# EAGLE schematic R3-URC18-4-002 (EAGLE 8.3.2)
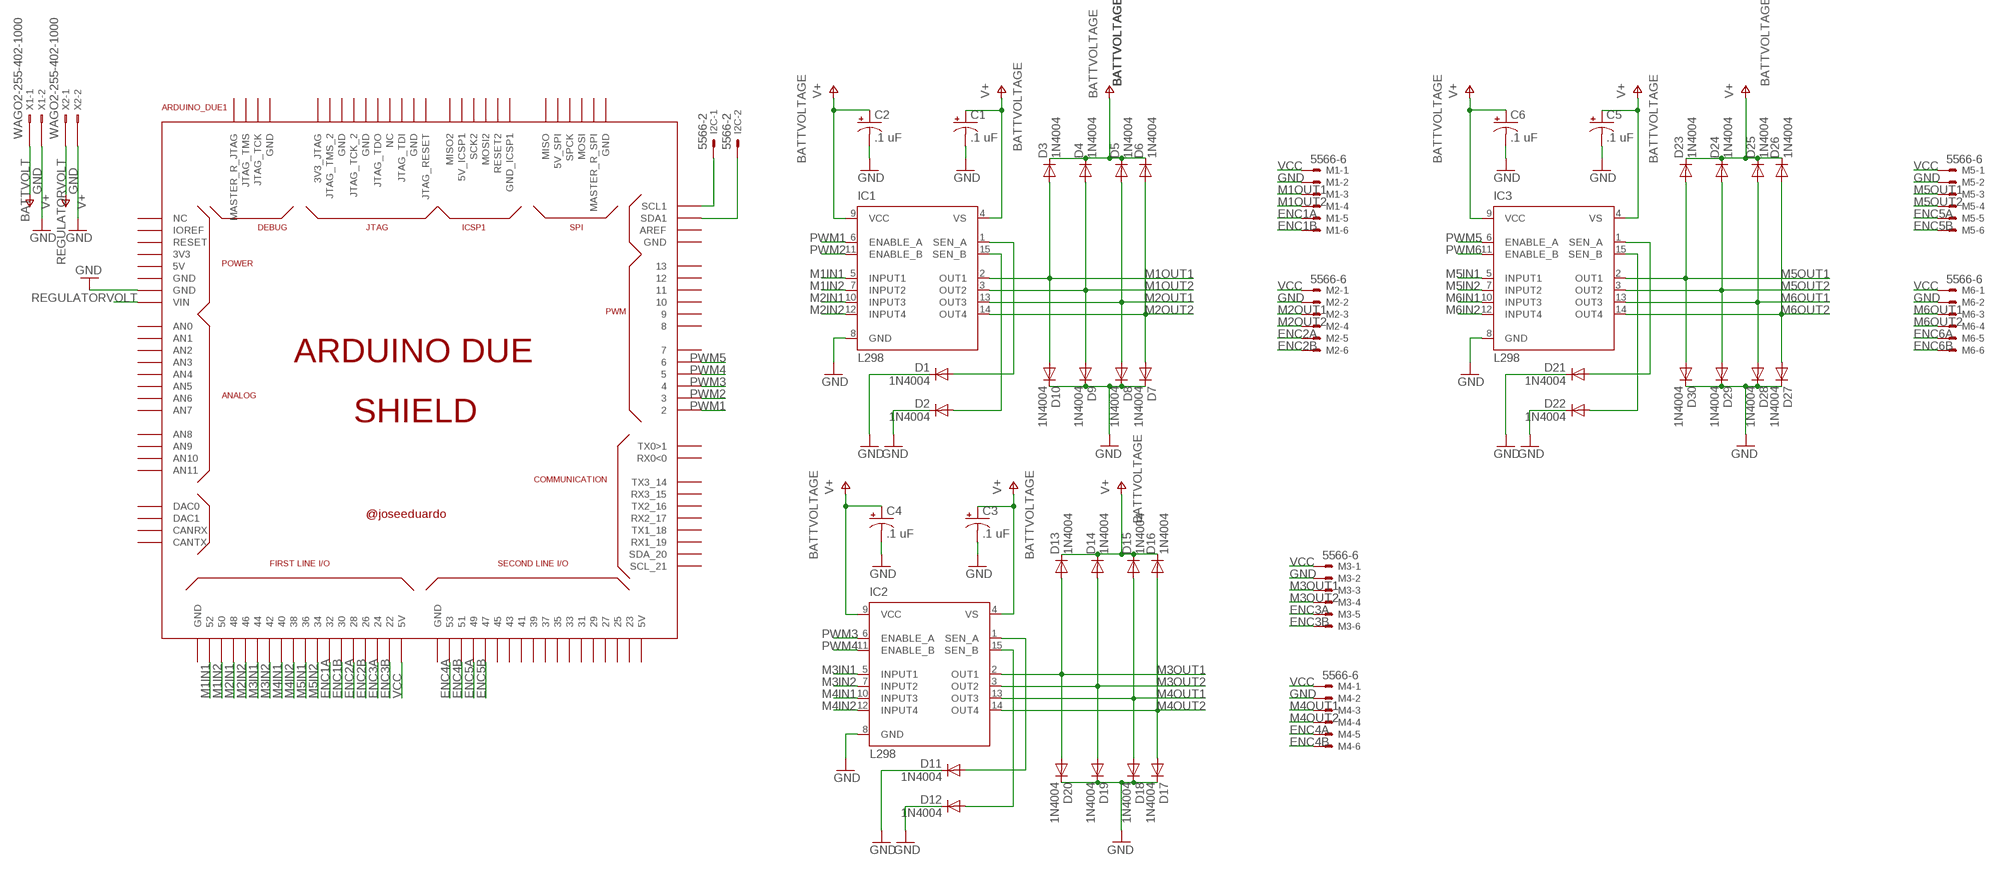
[diagram p0: schematic, sheet 1]

## Parts
ARDUINO_DUE1  ARDUINO_DUE_SHIELD  [ARDUINO_DUE_SHIELD]
C1  .1 uF  CPOL-USE5-6  [E5-6]
C2  .1 uF  CPOL-USE5-6  [E5-6]
C3  .1 uF  CPOL-USE5-6  [E5-6]
C4  .1 uF  CPOL-USE5-6  [E5-6]
C5  .1 uF  CPOL-USE5-6  [E5-6]
C6  .1 uF  CPOL-USE5-6  [E5-6]
D1  1N4004  [DO41-10]
D2  1N4004  [DO41-10]
D3  1N4004  [DO41-10]
D4  1N4004  [DO41-10]
D5  1N4004  [DO41-10]
D6  1N4004  [DO41-10]
D7  1N4004  [DO41-10]
D8  1N4004  [DO41-10]
D9  1N4004  [DO41-10]
D10  1N4004  [DO41-10]
D11  1N4004  [DO41-10]
D12  1N4004  [DO41-10]
D13  1N4004  [DO41-10]
D14  1N4004  [DO41-10]
D15  1N4004  [DO41-10]
D16  1N4004  [DO41-10]
D17  1N4004  [DO41-10]
D18  1N4004  [DO41-10]
D19  1N4004  [DO41-10]
D20  1N4004  [DO41-10]
D21  1N4004  [DO41-10]
D22  1N4004  [DO41-10]
D23  1N4004  [DO41-10]
D24  1N4004  [DO41-10]
D25  1N4004  [DO41-10]
D26  1N4004  [DO41-10]
D27  1N4004  [DO41-10]
D28  1N4004  [DO41-10]
D29  1N4004  [DO41-10]
D30  1N4004  [DO41-10]
I2C  5566-2  [5566-2]
IC1  L298  [MULTIWATT-15]
IC2  L298  [MULTIWATT-15]
IC3  L298  [MULTIWATT-15]
M1  5566-6  [5566-6]
M2  5566-6  [5566-6]
M3  5566-6  [5566-6]
M4  5566-6  [5566-6]
M5  5566-6  [5566-6]
M6  5566-6  [5566-6]
X1  WAGO2-255-402-1000  [255-402-1000]
X2  WAGO2-255-402-1000  [255-402-1000]

## Nets
BATTVOLT: X1.B1(-1:B1) ; supply symbol labelled V+
BATTVOLTAGE: C1.+ C2.+ C3.+ C4.+ C5.+ C6.+ D3.C D4.C D5.C D6.C D13.C D14.C D15.C D16.C D23.C D24.C D25.C D26.C IC1.4(VS) IC1.9(VCC) IC2.4(VS) IC2.9(VCC) IC3.4(VS) IC3.9(VCC) ; supply symbol labelled V+
ENC1A: ARDUINO_DUE1.32 M1.5
ENC1B: ARDUINO_DUE1.30 M1.6
ENC2A: ARDUINO_DUE1.28 M2.5
ENC2B: ARDUINO_DUE1.26 M2.6
ENC3A: ARDUINO_DUE1.24 M3.5
ENC3B: ARDUINO_DUE1.22 M3.6
ENC4A: ARDUINO_DUE1.53 M4.5
ENC4B: ARDUINO_DUE1.51 M4.6
ENC5A: ARDUINO_DUE1.49 M5.5
ENC5B: ARDUINO_DUE1.47 M5.6
ENC6A: M6.5
ENC6B: M6.6
GND: ARDUINO_DUE1.GND_1(GND) C1.- C2.- C3.- C4.- C5.- C6.- D1.C D2.C D7.C D8.C D9.C D10.C D11.C D12.C D17.C D18.C D19.C D20.C D21.C D22.C D27.C D28.C D29.C D30.C IC1.8(GND) IC2.8(GND) IC3.8(GND) M1.2 M2.2 M3.2 M4.2 M5.2 M6.2 X1.B2(-2:B1) X2.B2(-2:B1)
M1IN1: ARDUINO_DUE1.52 IC1.5(INPUT1)
M1IN2: ARDUINO_DUE1.50 IC1.7(INPUT2)
M1OUT1: D3.A D10.A IC1.2(OUT1) M1.3
M1OUT2: D4.A D9.A IC1.3(OUT2) M1.4
M2IN1: ARDUINO_DUE1.48 IC1.10(INPUT3)
M2IN2: ARDUINO_DUE1.46 IC1.12(INPUT4)
M2OUT1: D5.A D8.A IC1.13(OUT3) M2.3
M2OUT2: D6.A D7.A IC1.14(OUT4) M2.4
M3IN1: ARDUINO_DUE1.44 IC2.5(INPUT1)
M3IN2: ARDUINO_DUE1.42 IC2.7(INPUT2)
M3OUT1: D13.A D20.A IC2.2(OUT1) M3.3
M3OUT2: D14.A D19.A IC2.3(OUT2) M3.4
M4IN1: ARDUINO_DUE1.40 IC2.10(INPUT3)
M4IN2: ARDUINO_DUE1.38 IC2.12(INPUT4)
M4OUT1: D15.A D18.A IC2.13(OUT3) M4.3
M4OUT2: D16.A D17.A IC2.14(OUT4) M4.4
M5IN1: ARDUINO_DUE1.36 IC3.5(INPUT1)
M5IN2: ARDUINO_DUE1.34 IC3.7(INPUT2)
M5OUT1: D23.A D30.A IC3.2(OUT1) M5.3
M5OUT2: D24.A D29.A IC3.3(OUT2) M5.4
M6IN1: IC3.10(INPUT3)
M6IN2: IC3.12(INPUT4)
M6OUT1: D25.A D28.A IC3.13(OUT3) M6.3
M6OUT2: D26.A D27.A IC3.14(OUT4) M6.4
N$1: D11.A IC2.1(SEN_A)
N$2: D12.A IC2.15(SEN_B)
N$3: ARDUINO_DUE1.SCL1 I2C.1
N$4: ARDUINO_DUE1.SDA1 I2C.2
N$6: D21.A IC3.1(SEN_A)
N$7: D22.A IC3.15(SEN_B)
N$8: D1.A IC1.1(SEN_A)
N$9: D2.A IC1.15(SEN_B)
PWM1: ARDUINO_DUE1.2 IC1.6(ENABLE_A)
PWM2: ARDUINO_DUE1.3 IC1.11(ENABLE_B)
PWM3: ARDUINO_DUE1.4 IC2.6(ENABLE_A)
PWM4: ARDUINO_DUE1.5 IC2.11(ENABLE_B)
PWM5: ARDUINO_DUE1.6 IC3.6(ENABLE_A)
PWM6: IC3.11(ENABLE_B)
REGULATORVOLT: ARDUINO_DUE1.VIN X2.B1(-1:B1) ; supply symbol labelled V+
VCC: ARDUINO_DUE1.5V0_1(5V) M1.1 M2.1 M3.1 M4.1 M5.1 M6.1
Unconnected: ARDUINO_DUE1.0(RX0<0) ARDUINO_DUE1.1(TX0>1) ARDUINO_DUE1.3V3 ARDUINO_DUE1.3V3_JTAG ARDUINO_DUE1.5V0(5V) ARDUINO_DUE1.5V0_2(5V) ARDUINO_DUE1.5V_2(5V_SPI) ARDUINO_DUE1.5V_ICSP1 ARDUINO_DUE1.7 ARDUINO_DUE1.8 ARDUINO_DUE1.9 ARDUINO_DUE1.10 ARDUINO_DUE1.11 ARDUINO_DUE1.12 ARDUINO_DUE1.13 ARDUINO_DUE1.14(TX3_14) ARDUINO_DUE1.15(RX3_15) ARDUINO_DUE1.16(TX2_16) ARDUINO_DUE1.17(RX2_17) ARDUINO_DUE1.18(TX1_18) ARDUINO_DUE1.19(RX1_19) ARDUINO_DUE1.20(SDA_20) ARDUINO_DUE1.21(SCL_21) ARDUINO_DUE1.23 ARDUINO_DUE1.25 ARDUINO_DUE1.27 ARDUINO_DUE1.29 ARDUINO_DUE1.31 ARDUINO_DUE1.33 ARDUINO_DUE1.35 ARDUINO_DUE1.37 ARDUINO_DUE1.39 ARDUINO_DUE1.41 ARDUINO_DUE1.43 ARDUINO_DUE1.45 ARDUINO_DUE1.A0(AN0) ARDUINO_DUE1.A1(AN1) ARDUINO_DUE1.A2(AN2) ARDUINO_DUE1.A3(AN3) ARDUINO_DUE1.A4(AN4) ARDUINO_DUE1.A5(AN5) ARDUINO_DUE1.A6(AN6) ARDUINO_DUE1.A7(AN7) ARDUINO_DUE1.A8(AN8) ARDUINO_DUE1.A9(AN9) ARDUINO_DUE1.A10(AN10) ARDUINO_DUE1.A11(AN11) ARDUINO_DUE1.AREF ARDUINO_DUE1.CANRX ARDUINO_DUE1.CANTX ARDUINO_DUE1.DAC0 ARDUINO_DUE1.DAC1 ARDUINO_DUE1.GND ARDUINO_DUE1.GND_2(GND) ARDUINO_DUE1.GND_3(GND) ARDUINO_DUE1.GND_4(GND) ARDUINO_DUE1.GND_5(GND) ARDUINO_DUE1.GND_7(GND) ARDUINO_DUE1.GND_8(GND) ARDUINO_DUE1.GND_9(GND) ARDUINO_DUE1.GND_10(GND) ARDUINO_DUE1.GND_ICSP1 ARDUINO_DUE1.IOREF ARDUINO_DUE1.JTAG_RESET ARDUINO_DUE1.JTAG_TCK ARDUINO_DUE1.JTAG_TCK_2 ARDUINO_DUE1.JTAG_TDI ARDUINO_DUE1.JTAG_TDO ARDUINO_DUE1.JTAG_TMS ARDUINO_DUE1.JTAG_TMS_2 ARDUINO_DUE1.MASTER_RESET_JTAG(MASTER_R_JTAG) ARDUINO_DUE1.MASTER_RESET_SPI(MASTER_R_SPI) ARDUINO_DUE1.MISO ARDUINO_DUE1.MISO2 ARDUINO_DUE1.MOSI ARDUINO_DUE1.MOSI2 ARDUINO_DUE1.NC_2(NC) ARDUINO_DUE1.NC_5(NC) ARDUINO_DUE1.RESET ARDUINO_DUE1.RESET2 ARDUINO_DUE1.SCK2 ARDUINO_DUE1.SPCK X1.A1(-1:A1) X1.A2(-2:A1) X2.A1(-1:A1) X2.A2(-2:A1)

## Library data of the parts
ARDUINO_DUE1 = arduino_due_shield:ARDUINO_DUE_SHIELD
C1-C6 = adafruit:CPOL-US: POLARIZED CAPACITOR, American symbol
D1-D30 = diode:1N4004: DIODE general purpose rectifier, 1 A
I2C = con-molex:5566-2: Mini FIT connector 2 pol Source: http://www.molex.com; OC_FARNELL: 1822072; OC_NEWARK: unknown
IC1-IC3 = st-microelectronics:L298: DUAL FULL-BRIDGE DRIVER; MPN: L298N; OC_FARNELL: 1589425; OC_NEWARK: 32M1527
M1-M6 = con-molex:5566-6: Mini FIT connector 6 pol Source: http://www.molex.com; MPN: 95566-61002; OC_FARNELL: unknown; OC_NEWARK: 22K8620
X1 X2 = con-wago:WAGO2-: WAGO Cage Clamp; OC_FARNELL: unknown; OC_NEWARK: unknown

## Net classes
0 default: width 0.203 mm, drill 0.406 mm, clearance 0.205 mm
1 power: width 0.61 mm, drill 0.406 mm, clearance 0.203 mm
2 gnd: width 0.305 mm, drill 0.406 mm, clearance 0.203 mm
3 power usb: width 0.508 mm, drill 0.406 mm, clearance 0.203 mm